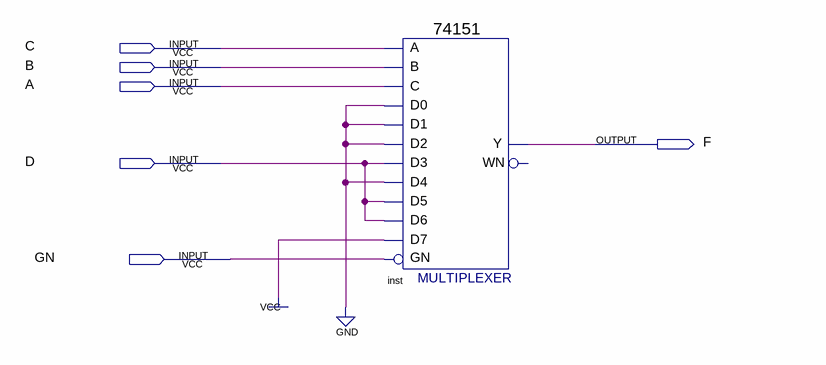
[diagram p0: schematic sheet]
// Quartus schematic block1.bdf as structural Verilog: 1 symbols, 6 pins
module block1 (
  input  C,
  input  B,
  input  A,
  input  D,
  input  GN,
  output F
);

  \74151  inst (
    .GN(GN), .C(A), .B(B), .A(C), .D5(D), .D0(1'b0), .D1(1'b0), .D4(1'b0), .D3(D), .D2(1'b0), .D6(D),
    .D7(1'b1), .Y(F));  // open: WN
endmodule
